# EAGLE schematic CALclock-r1 (EAGLE 9.6.2)
REV: 0.1
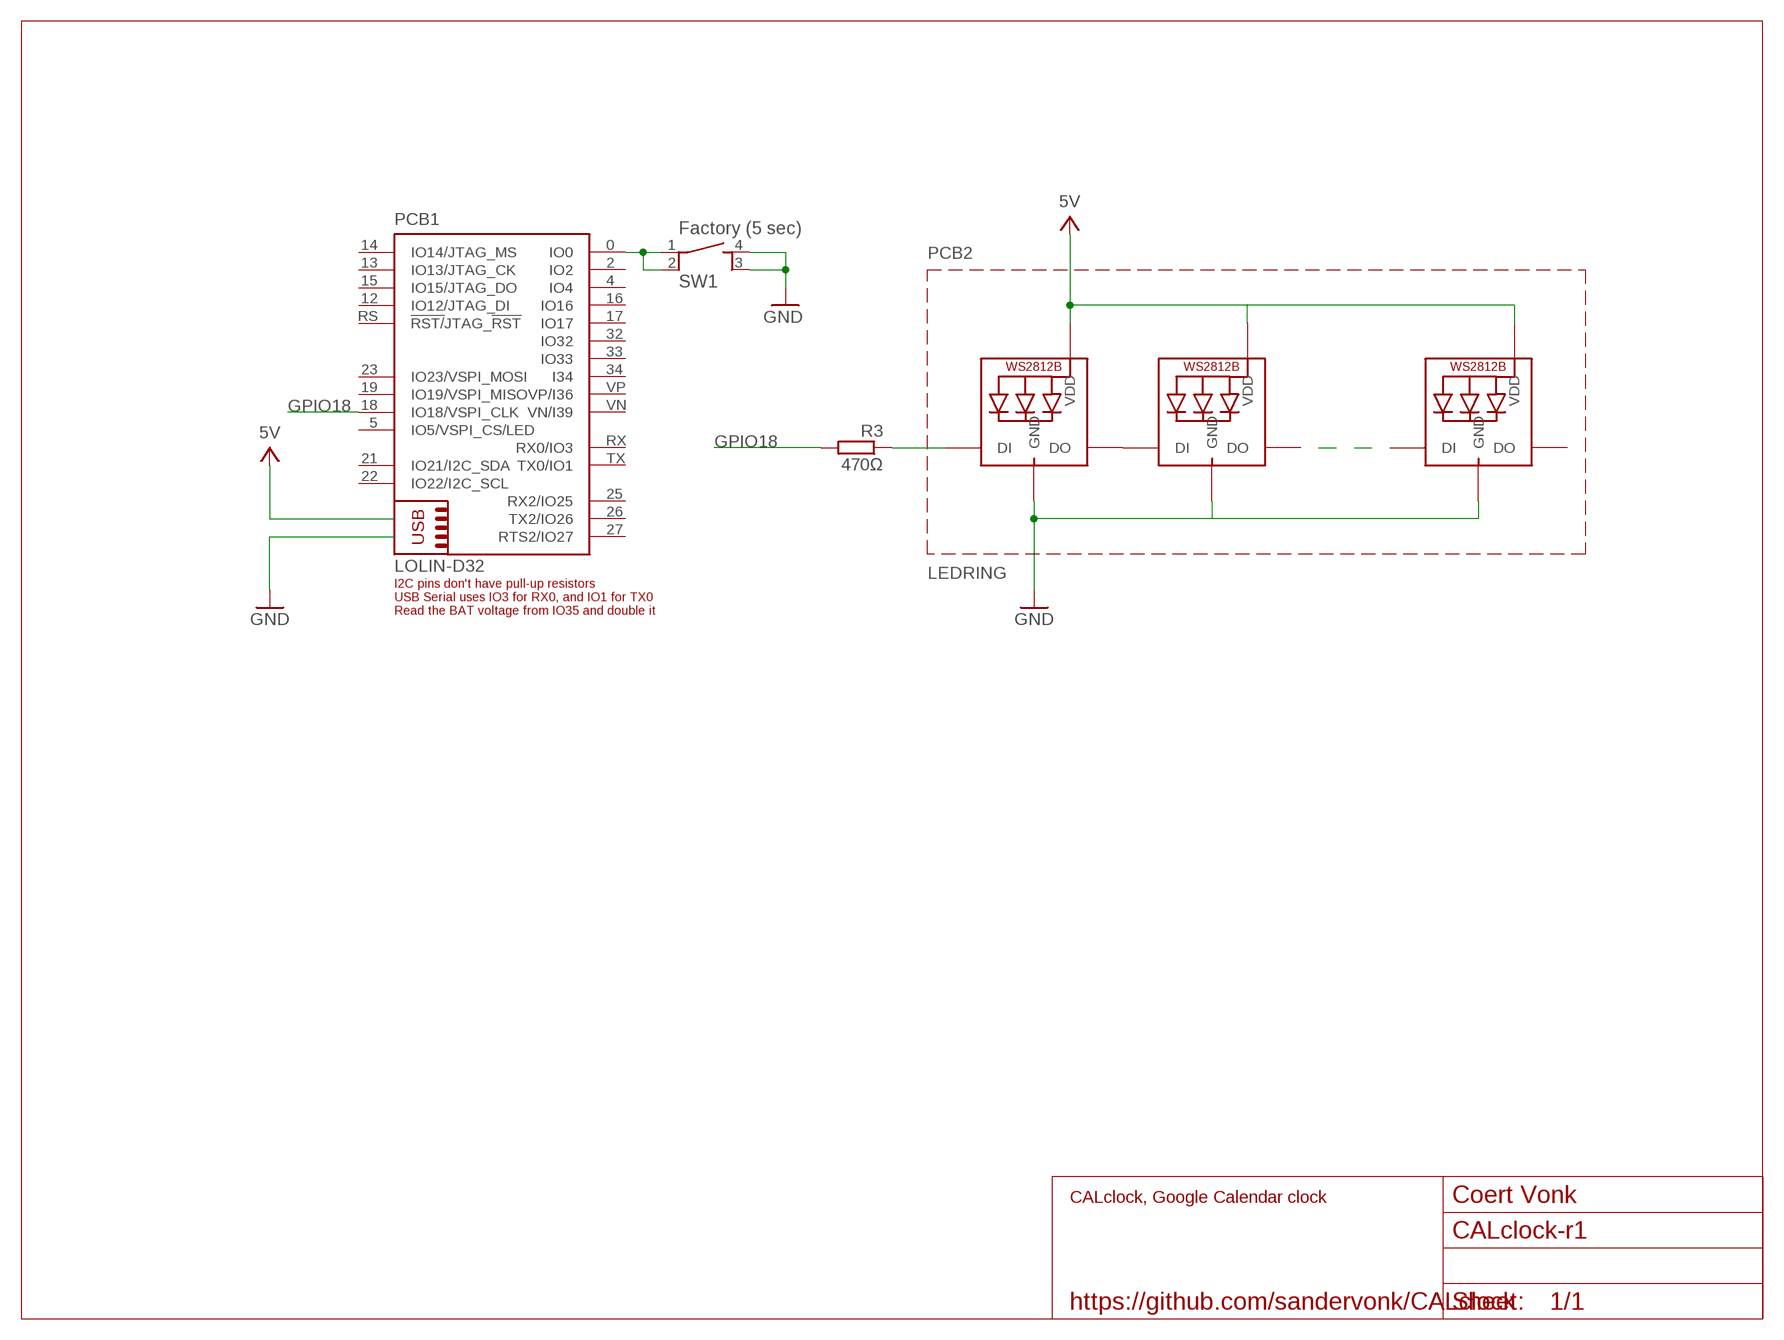
[diagram p0: schematic, sheet 1]
U$1 (FRAME_LETTER_L): AUTHOR_NAME: Coert Vonk; DESCRIPTION: CALclock, Google Calendar clock; REV: 1.1; URL: https://github.com/sandervonk/CALclock

## Parts
LED1  WS2812B5050  [WS2812B]
LED2  WS2812B5050  [WS2812B]
LED3  WS2812B5050  [WS2812B]
PCB1  LOLIN-D32  [LOLIN-D32]
R3  470Ω  R-EU_R0805  [R0805]
SW1  Factory (5 sec)  1-1825910-4  [TE_1-1825910-4]

## Nets
5V: LED1.1-VDD(VDD) LED3.1-VDD(VDD)
GND: LED1.3-GND(GND) LED3.3-GND(GND) SW1.3 SW1.4
GPIO18: PCB1.18(IO18/VSPI_CLK) R3.2
N$1: LED1.4-DIN(DI) R3.1
N$2: LED1.2-DOUT(DO) LED2.4-DIN(DI)
N$3: PCB1.0(IO0) SW1.1 SW1.2
N$4: LED2.3-GND(GND)
N$9: LED2.1-VDD(VDD)
Unconnected: LED2.2-DOUT(DO) LED3.2-DOUT(DO) LED3.4-DIN(DI) PCB1.2(IO2) PCB1.3V3(P:3V3) PCB1.4(IO4) PCB1.5(IO5/VSPI_CS/LED) PCB1.12(IO12/JTAG_DI) PCB1.13(IO13/JTAG_CK) PCB1.14(IO14/JTAG_MS) PCB1.15(IO15/JTAG_DO) PCB1.16(IO16) PCB1.17(IO17) PCB1.19(IO19/VSPI_MISO) PCB1.21(IO21/I2C_SDA) PCB1.22(IO22/I2C_SCL) PCB1.23(IO23/VSPI_MOSI) PCB1.25(RX2/IO25) PCB1.26(TX2/IO26) PCB1.27(RTS2/IO27) PCB1.32(IO32) PCB1.33(IO33) PCB1.34(I34) PCB1.EN(P:EN) PCB1.GND(P:GND) PCB1.GND@1(P:GND) PCB1.GND@2(P:GND) PCB1.RS(!RST/!JTAG_!RST) PCB1.RX(RX0/IO3) PCB1.TX(TX0/IO1) PCB1.USB_5V(P:USB) PCB1.VN(VN/I39) PCB1.VP(VP/I36)

## Notes on the sheet
- PCB2
- LEDRING

## Power pins joined to a net without a drawn wire
BAT: PCB1.BAT(P:BAT)

## Library data of the parts
LED1-LED3 = WS2812B:WS2812B: Check availability <https://pricing.snapeda.com/parts/WS2812B/Seeed%20Technology/view-part?ref=eda>; AVAILABILITY: Not in stock; DESCRIPTION: Raspberry Pi 3 Arduino R3 Shield, Raspberry Pi HAT (40 pin) Wheeled Robotics Kit; MF: Seeed Technology; MP: WS2812B; PACKAGE: None; PRICE: None
PCB1 = Coert Vonk:LOLIN-D32: Wemos LOLIN D32, ESP-WROOM-32 Technical specifications: Manufacturer: Wemos SoC: ESP32-WROOM-32, 4 MByte flash, max 240MHz Optional battery: 3.7V Lipo, connector PH-2(2.0mm) UART: CH340, micro-USB connector Mfr.#: LOLIN D32, data sheet <https://wiki.wemos.cc/products:d32:d32> Alibaba: 32808551116, about $6.50; ALIEXPRESS#: 32808551116; MANF: WEMOS Electronics; MANF#: D32
R3 = rcl:R-EU_: RESISTOR, European symbol; MANF: Bourns; MANF#: CRM0805-JW-1R5ELF; MOUSER#: 652-CRM0805JW1R5ELF; SPICEPREFIX: R
SW1 = 1-1825910-4:1-1825910-4: Switch Tactile OFF (ON) SPST Round Button PC Pins 0.05A 24VDC 100000Cycles 1.56N Thru-Hole Loose; COMMENT: 1-1825910-4; DESCRIPTION: Switch Tactile OFF (ON) SPST Round Button PC Pins 0.05A 24VDC 100000Cycles 1.56N Thru-Hole; DIGI-KEY_PART_NUMBER: 450-1653-ND; MF: TE Connectivity; MP: 1-1825910-4; PACKAGE: None; PURCHASE-URL: https://pricing.snapeda.com/search/part/1-1825910-4/?ref=eda